# Altium schematic sheet Connectors.SchDoc
size A4; SheetNumber: 1; SheetTotal: 6
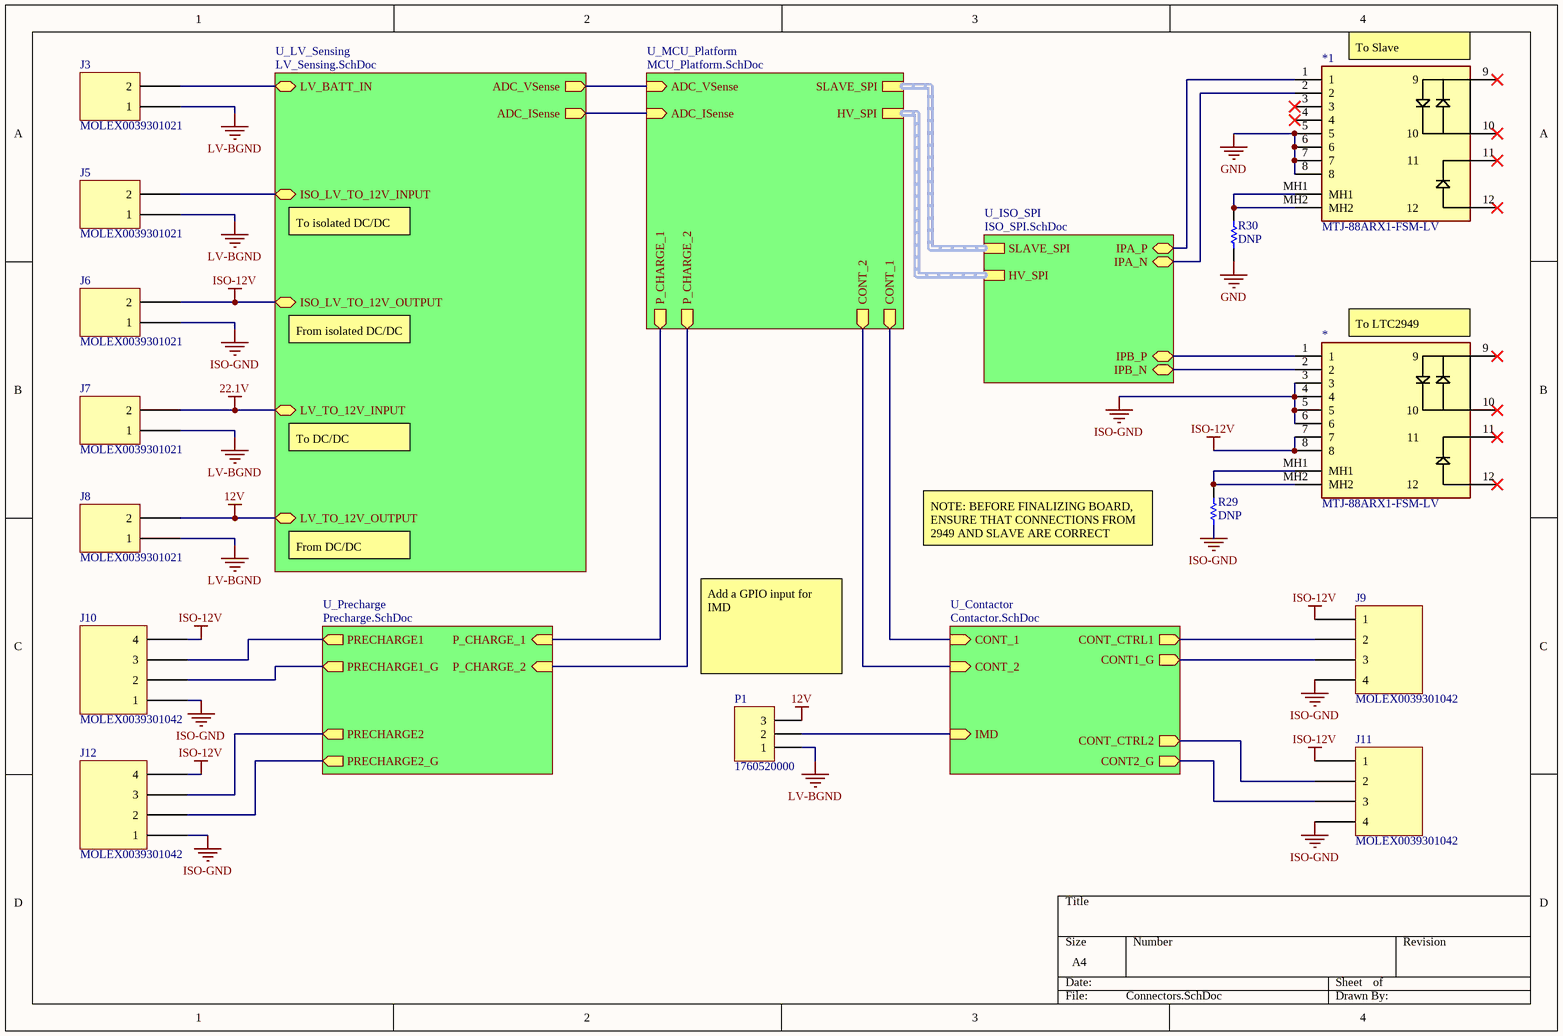
[diagram p0: Connectors.SchDoc]

## Parts
*  MTJ-88ARX1-FSM-LV  [MTJ-88ARX1-FSM-LV]
*1  MTJ-88ARX1-FSM-LV  [MTJ-88ARX1-FSM-LV]
J3  MOLEX0039301021  [MOLEX0039301021]
J5  MOLEX0039301021  [MOLEX0039301021]
J6  MOLEX0039301021  [MOLEX0039301021]
J7  MOLEX0039301021  [MOLEX0039301021]
J8  MOLEX0039301021  [MOLEX0039301021]
J9  MOLEX0039301042  [MOLEX0039301042]
J10  MOLEX0039301042  [MOLEX0039301042]
J11  MOLEX0039301042  [MOLEX0039301042]
J12  MOLEX0039301042  [MOLEX0039301042]
P1  1760520000  [1760520000]
R29  value DNP  [0805 - Resistor]  (hidden comment: Resistor)
R30  value DNP  [0805 - Resistor]  (hidden comment: Resistor)

## Sub-sheets
U_Contactor = Contactor.SchDoc: CONT_CTRL1 (out), CONT_CTRL2 (out), CONT1_G (out), CONT2_G (out), CONT_1 (in), CONT_2 (in), IMD (in)
U_ISO_SPI = ISO_SPI.SchDoc: IPA_P (bidir), IPA_N (bidir), IPB_P (bidir), IPB_N (bidir), SLAVE_SPI (harness SLAVE_SPI), HV_SPI (harness HV_SPI)
U_LV_Sensing = LV_Sensing.SchDoc: LV_BATT_IN (bidir), LV_TO_12V_INPUT (bidir), LV_TO_12V_OUTPUT (bidir), ISO_LV_TO_12V_INPUT (bidir), ISO_LV_TO_12V_OUTPUT (bidir), ADC_VSense (out), ADC_ISense (out)
U_MCU_Platform = MCU_Platform.SchDoc: SLAVE_SPI (harness SLAVE_SPI), HV_SPI (harness HV_SPI), P_CHARGE_1 (out), P_CHARGE_2 (out), CONT_1 (out), CONT_2 (out), ADC_VSense (in), ADC_ISense (in)
U_Precharge = Precharge.SchDoc: P_CHARGE_1 (in), P_CHARGE_2 (in), PRECHARGE1 (out), PRECHARGE2 (out), PRECHARGE1_G (out), PRECHARGE2_G (out)

## Nets
12V: J8.2 P1.3 ; sheet U_LV_Sensing/LV_TO_12V_OUTPUT
22.1V: J7.2 ; sheet U_LV_Sensing/LV_TO_12V_INPUT
GND: *1.5 *1.6 *1.7 *1.8 R30.1
ISO-12V: *.7 *.8 J6.2 J9.1 J10.4 J11.1 J12.4 ; sheet U_LV_Sensing/ISO_LV_TO_12V_OUTPUT
ISO-GND: *.3 *.4 *.5 *.6 J6.1 J9.4 J10.1 J11.4 J12.1 R29.1
LV-BGND: J3.1 J5.1 J7.1 J8.1 P1.1
Net*1_1: *1.1 ; sheet U_ISO_SPI/IPA_P
Net*1_2: *1.2 ; sheet U_ISO_SPI/IPA_N
Net*1_MH1: *1.MH1 *1.MH2 R30.2
Net*_1: *.1 ; sheet U_ISO_SPI/IPB_P
Net*_2: *.2 ; sheet U_ISO_SPI/IPB_N
Net*_MH1: *.MH1 *.MH2 R29.2
NetJ3_2: J3.2 ; sheet U_LV_Sensing/LV_BATT_IN
NetJ5_2: J5.2 ; sheet U_LV_Sensing/ISO_LV_TO_12V_INPUT
NetJ9_2: J9.2 ; sheet U_Contactor/CONT_CTRL1
NetJ9_3: J9.3 ; sheet U_Contactor/CONT1_G
NetJ10_2: J10.2 ; sheet U_Precharge/PRECHARGE1_G
NetJ10_3: J10.3 ; sheet U_Precharge/PRECHARGE1
NetJ11_2: J11.2 ; sheet U_Contactor/CONT_CTRL2
NetJ11_3: J11.3 ; sheet U_Contactor/CONT2_G
NetJ12_2: J12.2 ; sheet U_Precharge/PRECHARGE2_G
NetJ12_3: J12.3 ; sheet U_Precharge/PRECHARGE2
NetP1_2: P1.2 ; sheet U_Contactor/IMD
(unnamed): sheet U_Contactor/CONT_1, sheet U_MCU_Platform/CONT_1
(unnamed): sheet U_Contactor/CONT_2, sheet U_MCU_Platform/CONT_2
(unnamed): sheet U_MCU_Platform/P_CHARGE_1, sheet U_Precharge/P_CHARGE_1
(unnamed): sheet U_MCU_Platform/P_CHARGE_2, sheet U_Precharge/P_CHARGE_2
(unnamed): sheet U_MCU_Platform/ADC_VSense, sheet U_LV_Sensing/ADC_VSense
(unnamed): sheet U_MCU_Platform/ADC_ISense, sheet U_LV_Sensing/ADC_ISense

Not connected (* = marked no-connect by the designer): * 9* 10* 11* 12*; *1 3* 4* 9* 10* 11* 12*

## Buses and harness runs
harness sheet U_ISO_SPI/HV_SPI = sheet U_MCU_Platform/HV_SPI
harness sheet U_ISO_SPI/SLAVE_SPI = sheet U_MCU_Platform/SLAVE_SPI

## Notes on the sheet
- (near *1) To Slave
- To isolated DC/DC
- From isolated DC/DC
- (near *) To LTC2949
- To DC/DC
- From DC/DC
- NOTE: BEFORE FINALIZING BOARD, ENSURE THAT CONNECTIONS FROM 2949 AND SLAVE ARE CORRECT
- (near P1) Add a GPIO input for IMD

## Library data of the parts
* *1 = MTJ-88ARX1-FSM-LV: RJ45 Connector
J3 J5-J8 = MOLEX0039301021: Connector Header Through Hole, Right Angle 2 pin 0.165" (4.20mm)
J9-J12 = MOLEX0039301042: Connector Header Through Hole, Right Angle 4 position 0.165" (4.20mm); Manufacturer: Molex; Manufacturer Part Number: 0039301042; Supplier: Digikey; Supplier Part Number: WM21364-ND; ComponentLink1Description: Datasheet; ComponentLink1URL: https://www.molex.com/pdm_docs/sd/039301042_sd.pdf
P1 = 1760520000: 1x3 Screw Terminal Block; Manufacturer: Weidmüller; Manufacturer Part Number: 1760520000; Supplier: Digikey; Supplier Part Number: 281-1883-ND; ComponentLink1Description: Datasheet; ComponentLink1URL: https://media.digikey.com/pdf/Data%20Sheets/Weidmuller%20PDFs/1760520000.pdf
R29 R30 = Resistor: Rating: *; Manufacturer Part Number: *; Manufacturer: *; Supplier Part Number: *; Supplier: *